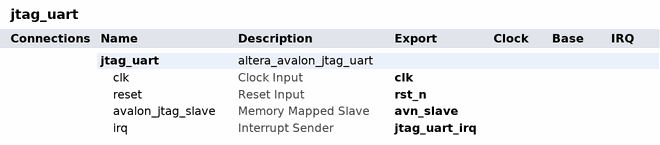
[diagram p0: system contents]
# Platform Designer (Qsys) system jtag_uart, Cyclone IV E EP4CE6E22C8
# Parameters at their usual value, and those the tool derives, are not listed.
package require -exact qsys 22.1
create_system jtag_uart
set_project_property DEVICE_FAMILY {Cyclone IV E}
set_project_property DEVICE EP4CE6E22C8

add_instance jtag_uart altera_avalon_jtag_uart 22.1
set_instance_parameter_value jtag_uart simInteractiveOptions NO_INTERACTIVE_WINDOWS

# exported interfaces
add_interface avn_slave avalon slave
set_interface_property avn_slave EXPORT_OF jtag_uart.avalon_jtag_slave
add_interface clk clock sink
set_interface_property clk EXPORT_OF jtag_uart.clk
add_interface jtag_uart_irq interrupt sender
set_interface_property jtag_uart_irq EXPORT_OF jtag_uart.irq
add_interface rst_n reset sink
set_interface_property rst_n EXPORT_OF jtag_uart.reset

set_interconnect_requirement {$system} qsys_mm.clockCrossingAdapter HANDSHAKE
set_interconnect_requirement {$system} qsys_mm.enableEccProtection FALSE
set_interconnect_requirement {$system} qsys_mm.insertDefaultSlave FALSE
set_interconnect_requirement {$system} qsys_mm.maxAdditionalLatency 1

save_system jtag_uart.qsys
